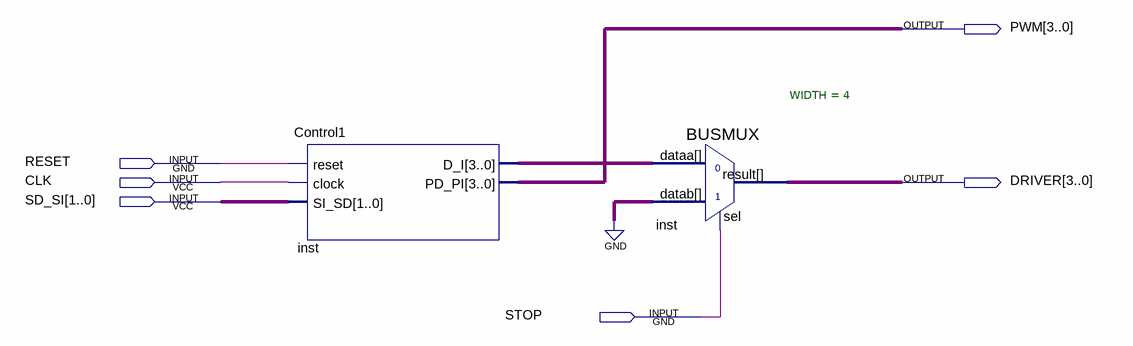
[diagram p0: schematic sheet]
// Quartus schematic BLOQUEFINAL.bdf as structural Verilog: 2 symbols, 6 pins
module BLOQUEFINAL (
  input  RESET,
  input  CLK,
  input  [1:0] SD_SI,
  input  STOP,
  output [3:0] PWM,
  output [3:0] DRIVER
);

  wire [3:0] inst_d_i;

  Control1 inst (.reset(RESET), .clock(CLK), .SI_SD(SD_SI), .D_I(inst_d_i), .PD_PI(PWM));
  BUSMUX #(.WIDTH(4)) inst_dup2 (.datab(4'b0000), .sel(STOP), .dataa(inst_d_i), .result(DRIVER));
endmodule
